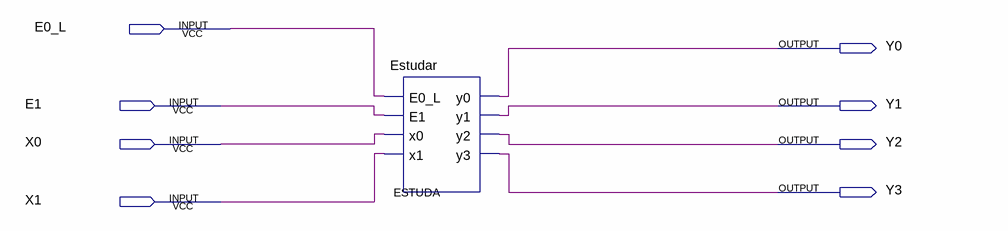
[diagram p0: schematic sheet]
// Quartus schematic DecoderDemo.bdf as structural Verilog: 1 symbols, 8 pins
module DecoderDemo (
  input  E0_L,
  input  E1,
  input  X0,
  input  X1,
  output Y0,
  output Y1,
  output Y2,
  output Y3
);

  Estudar ESTUDA (.E0_L(E0_L), .E1(E1), .x0(X0), .x1(X1), .y0(Y0), .y1(Y1), .y2(Y2), .y3(Y3));
endmodule
